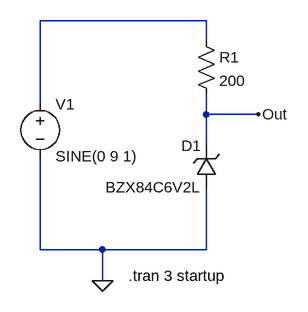
[diagram p0: schematic Zener1.asc]
Zener1.asc, the LTspice schematic file:
Version 4.1
SHEET 1 880 680
WIRE 208 16 -48 16
WIRE 208 48 208 16
WIRE -48 144 -48 16
WIRE 208 160 208 128
WIRE 288 160 208 160
WIRE 208 208 208 160
WIRE -48 368 -48 224
WIRE 48 368 -48 368
WIRE 208 368 208 272
WIRE 208 368 48 368
WIRE 48 416 48 368
FLAG 48 416 0
FLAG 288 160 Out
SYMBOL zener 224 272 R180
WINDOW 0 24 64 Left 2
WINDOW 3 24 0 Left 2
SYMATTR InstName D1
SYMATTR Value BZX84C6V2L
SYMATTR Description Diode
SYMATTR Type diode
SYMBOL res 192 32 R0
SYMATTR InstName R1
SYMATTR Value 200
SYMBOL voltage -48 128 R0
WINDOW 123 0 0 Left 0
WINDOW 39 0 0 Left 0
SYMATTR InstName V1
SYMATTR Value SINE(0 9 1)
TEXT 88 408 Left 2 !.tran 3 startup

The netlist it stands for:
* Zener1.asc
D1 0 Out BZX84C6V2L
R1 N001 Out 200
V1 N001 0 SINE(0 9 1)
.model D D
.lib standard.dio
.tran 3 startup
.backanno
.end